# Altium schematic sheet Sensors.SchDoc
size A; SheetNumber: 2; SheetTotal: 2
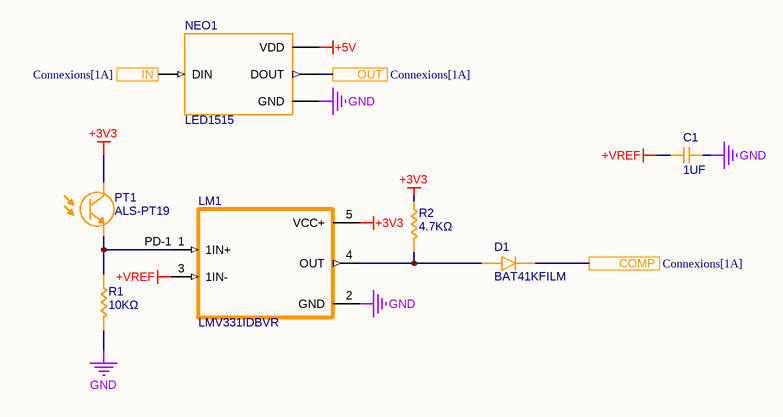
[diagram p0: Sensors.SchDoc]

## Parts
C1  1UF  [CAP_0603]
D1  BAT41KFILM  [BAT41KFILM]
LM1  LMV331IDBVR  [LMV331IDBVR]
NEO1  LED1515  [LED1515]
PT1  ALS-PT19  [ALS-PT19]
R1  10KΩ  [RES_0603]
R2  4.7KΩ  [RES_0603]

## Ports
COMP (see Connexions[1A]), IN (see Connexions[1A]), OUT (see Connexions[1A])

## Nets
+3V3: LM1.5(VCC+) PT1.C R2.2
+5V: NEO1.VDD
+VREF: C1.2 LM1.3(1IN-)
GND: C1.1 LM1.2(GND) NEO1.GND R1.1
COMP: D1.C(K) ; port COMP
IN: NEO1.DIN ; port IN
OUT: NEO1.DOUT ; port OUT
PD-1: LM1.1(1IN+) PT1.E R1.2
NetD1_A: D1.A LM1.4(OUT) R2.1

## Library data of the parts
C1 = CAP_0603: Capacitor SMD 0603 generic
R1 R2 = RES_0603: Resistor SMD 0603 generic